# EAGLE schematic TEPIAmainboard (EAGLE 8.0.1)
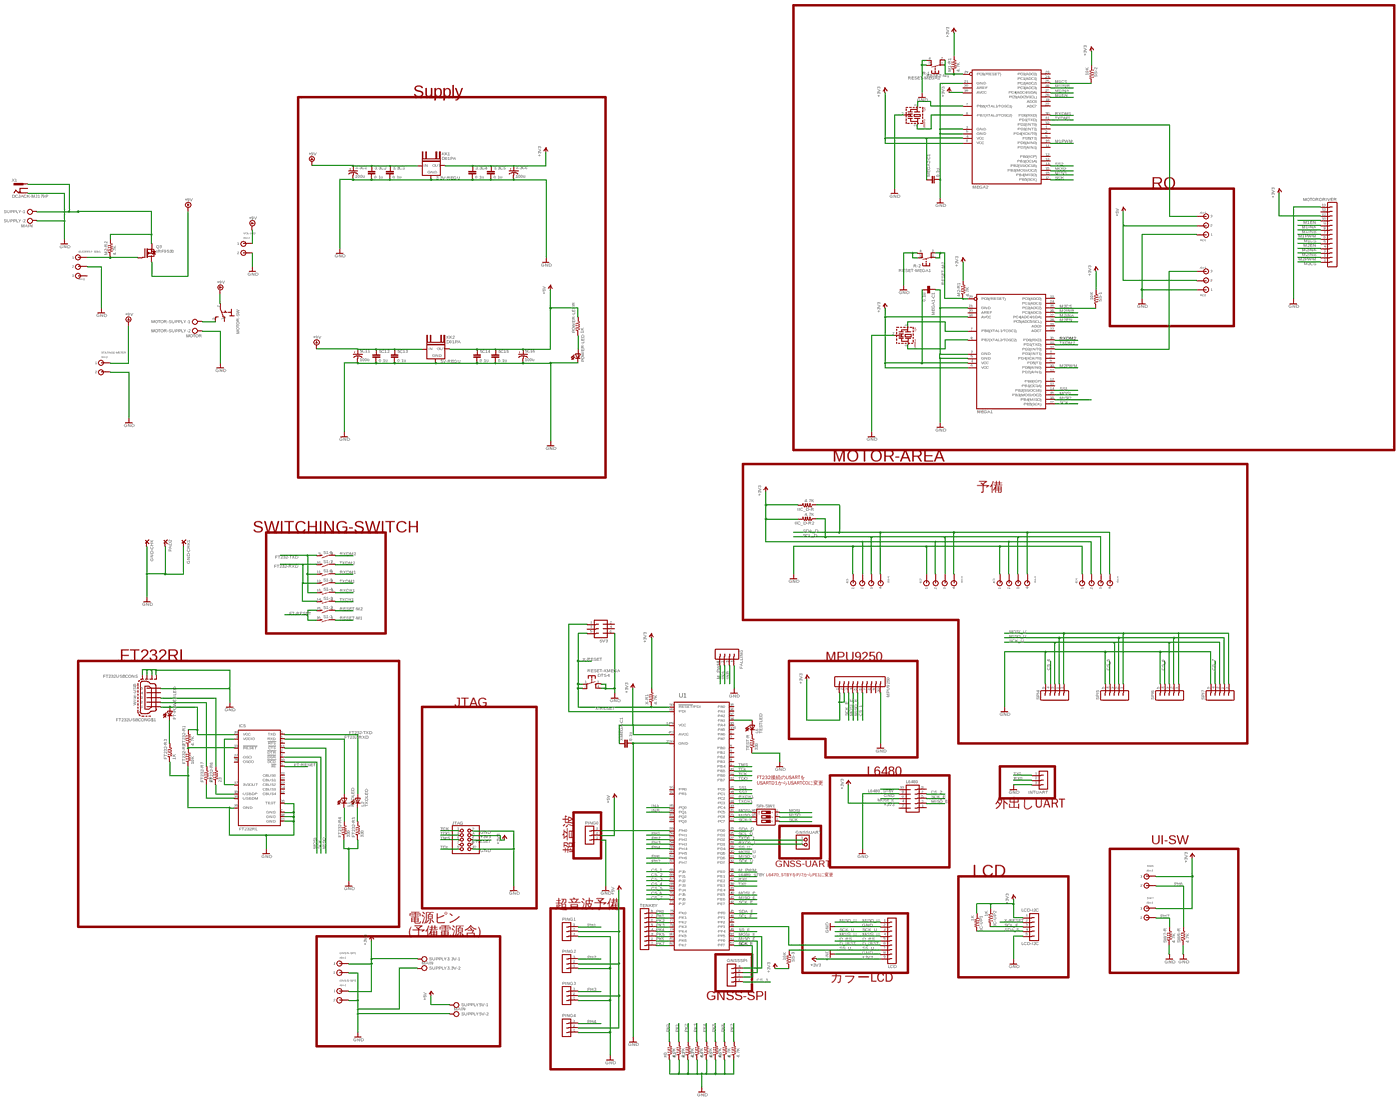
[diagram p0: schematic, sheet 1, overview]
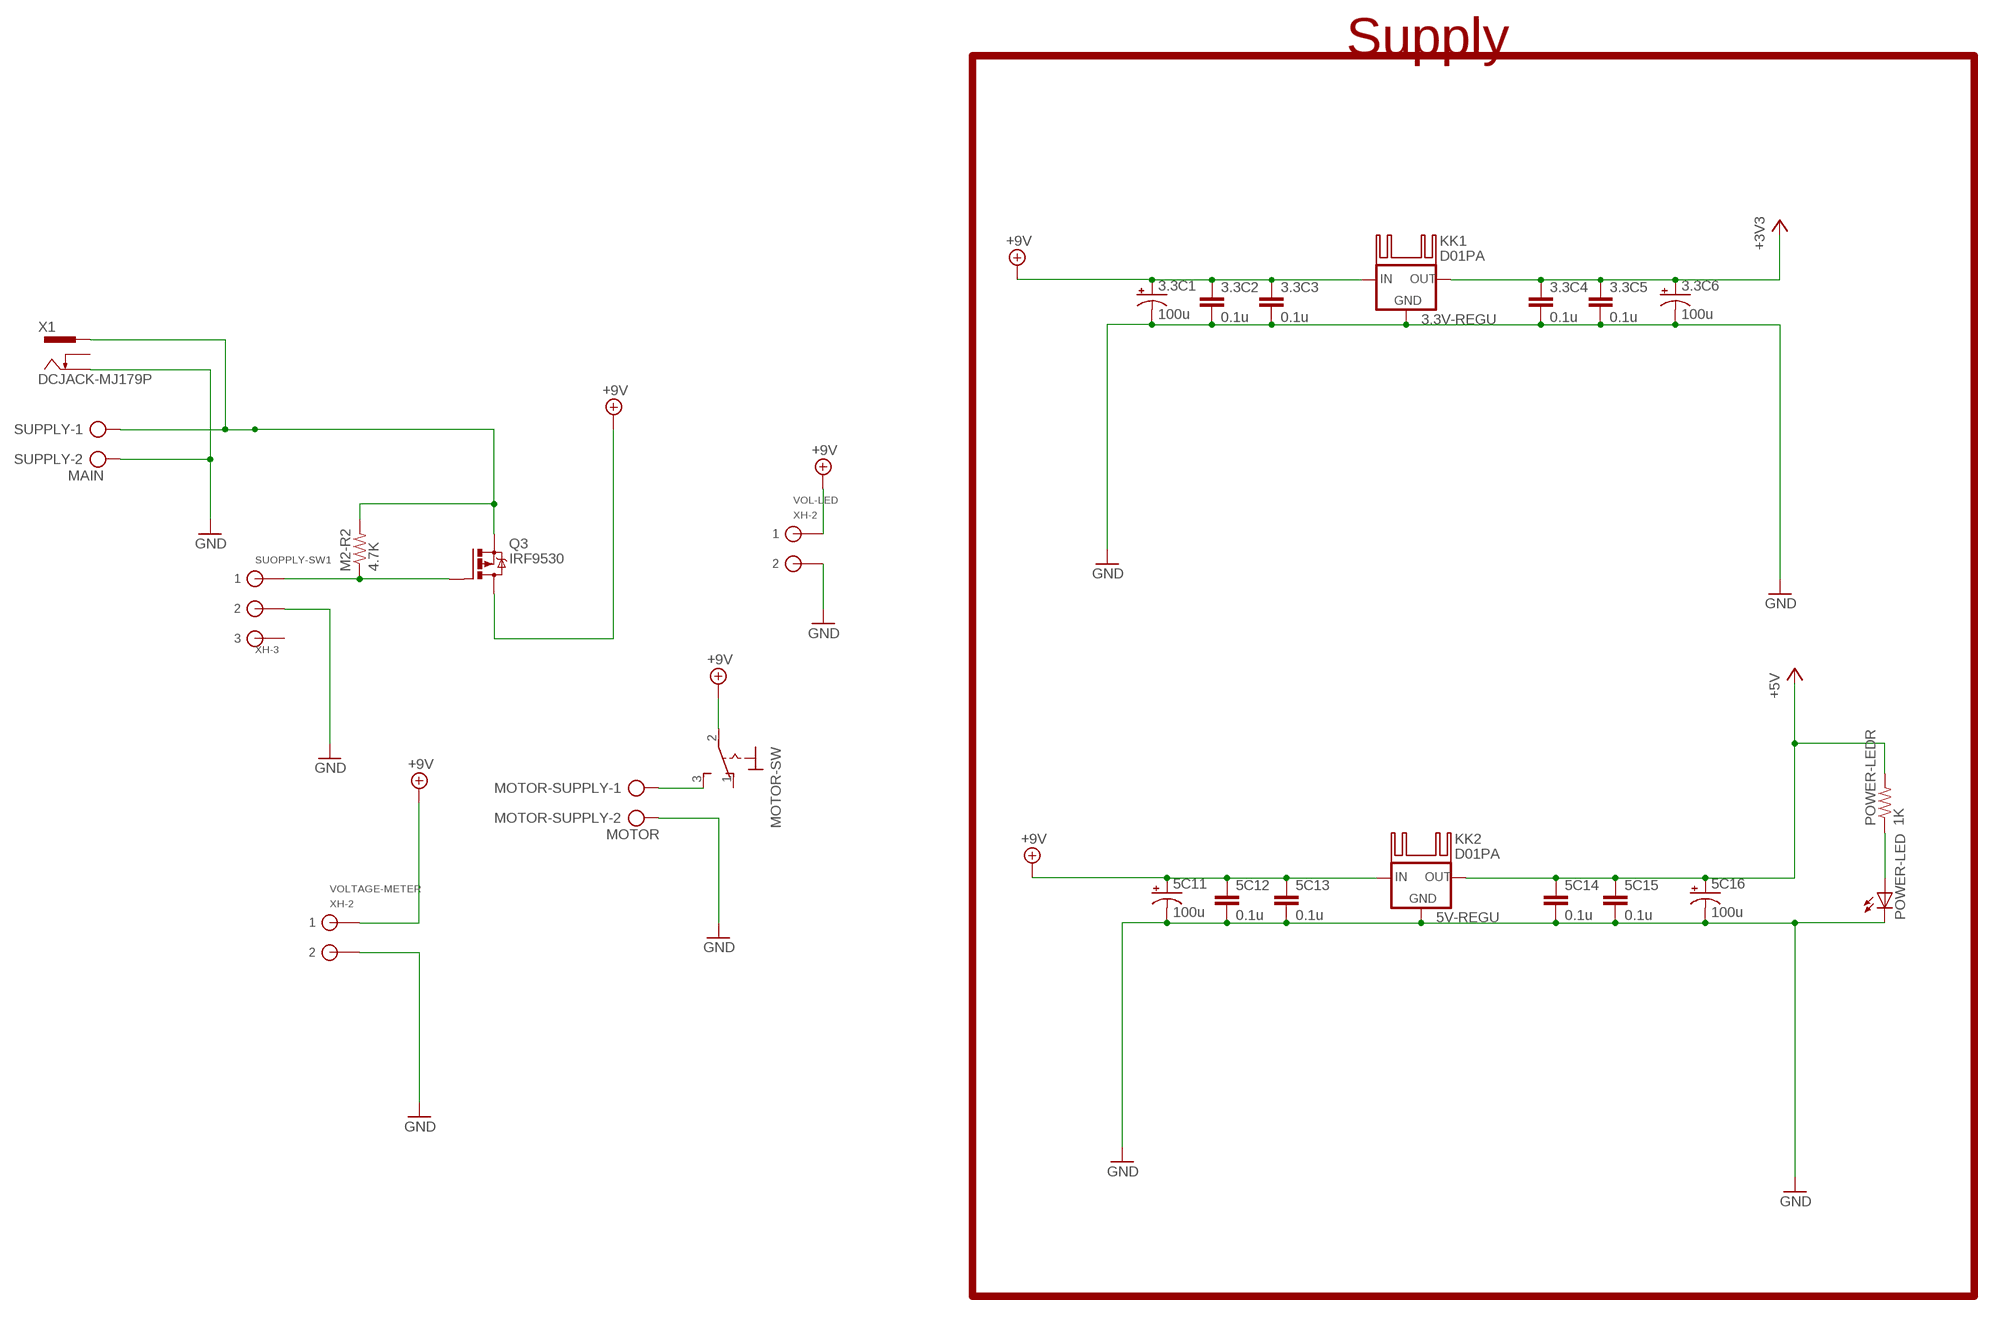
[diagram p1: schematic, sheet 1, part 1 of 4]
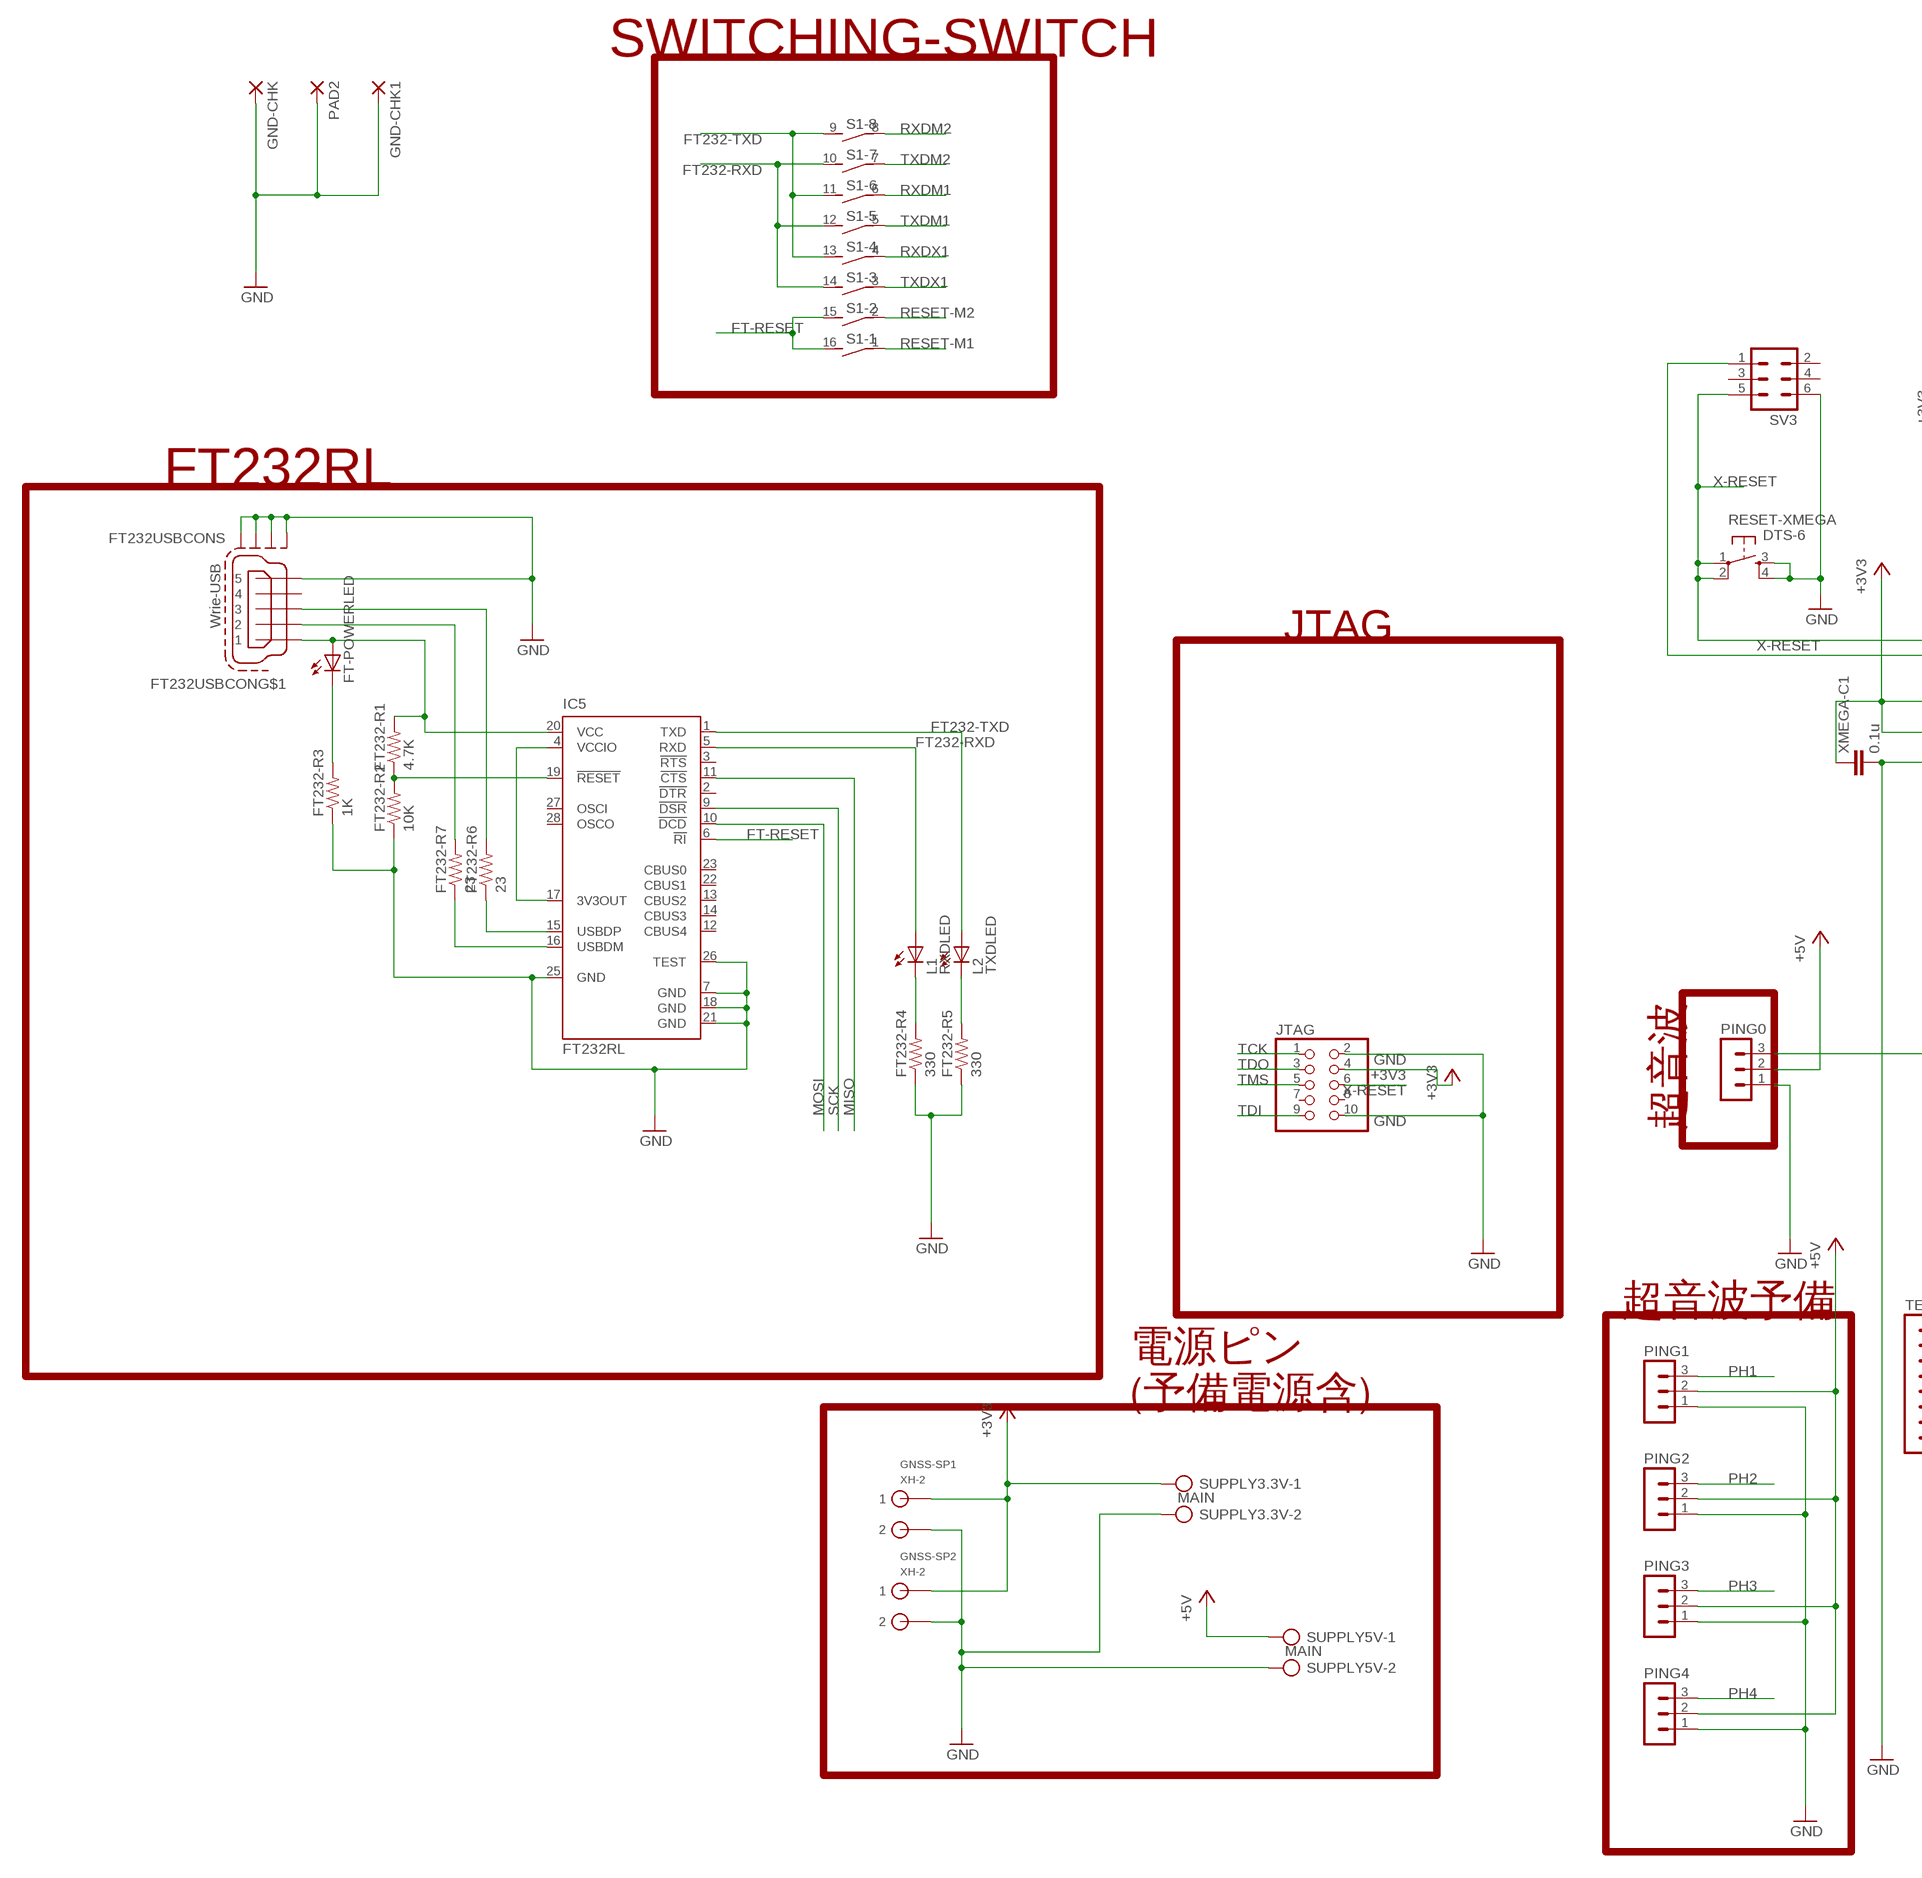
[diagram p2: schematic, sheet 1, part 2 of 4]
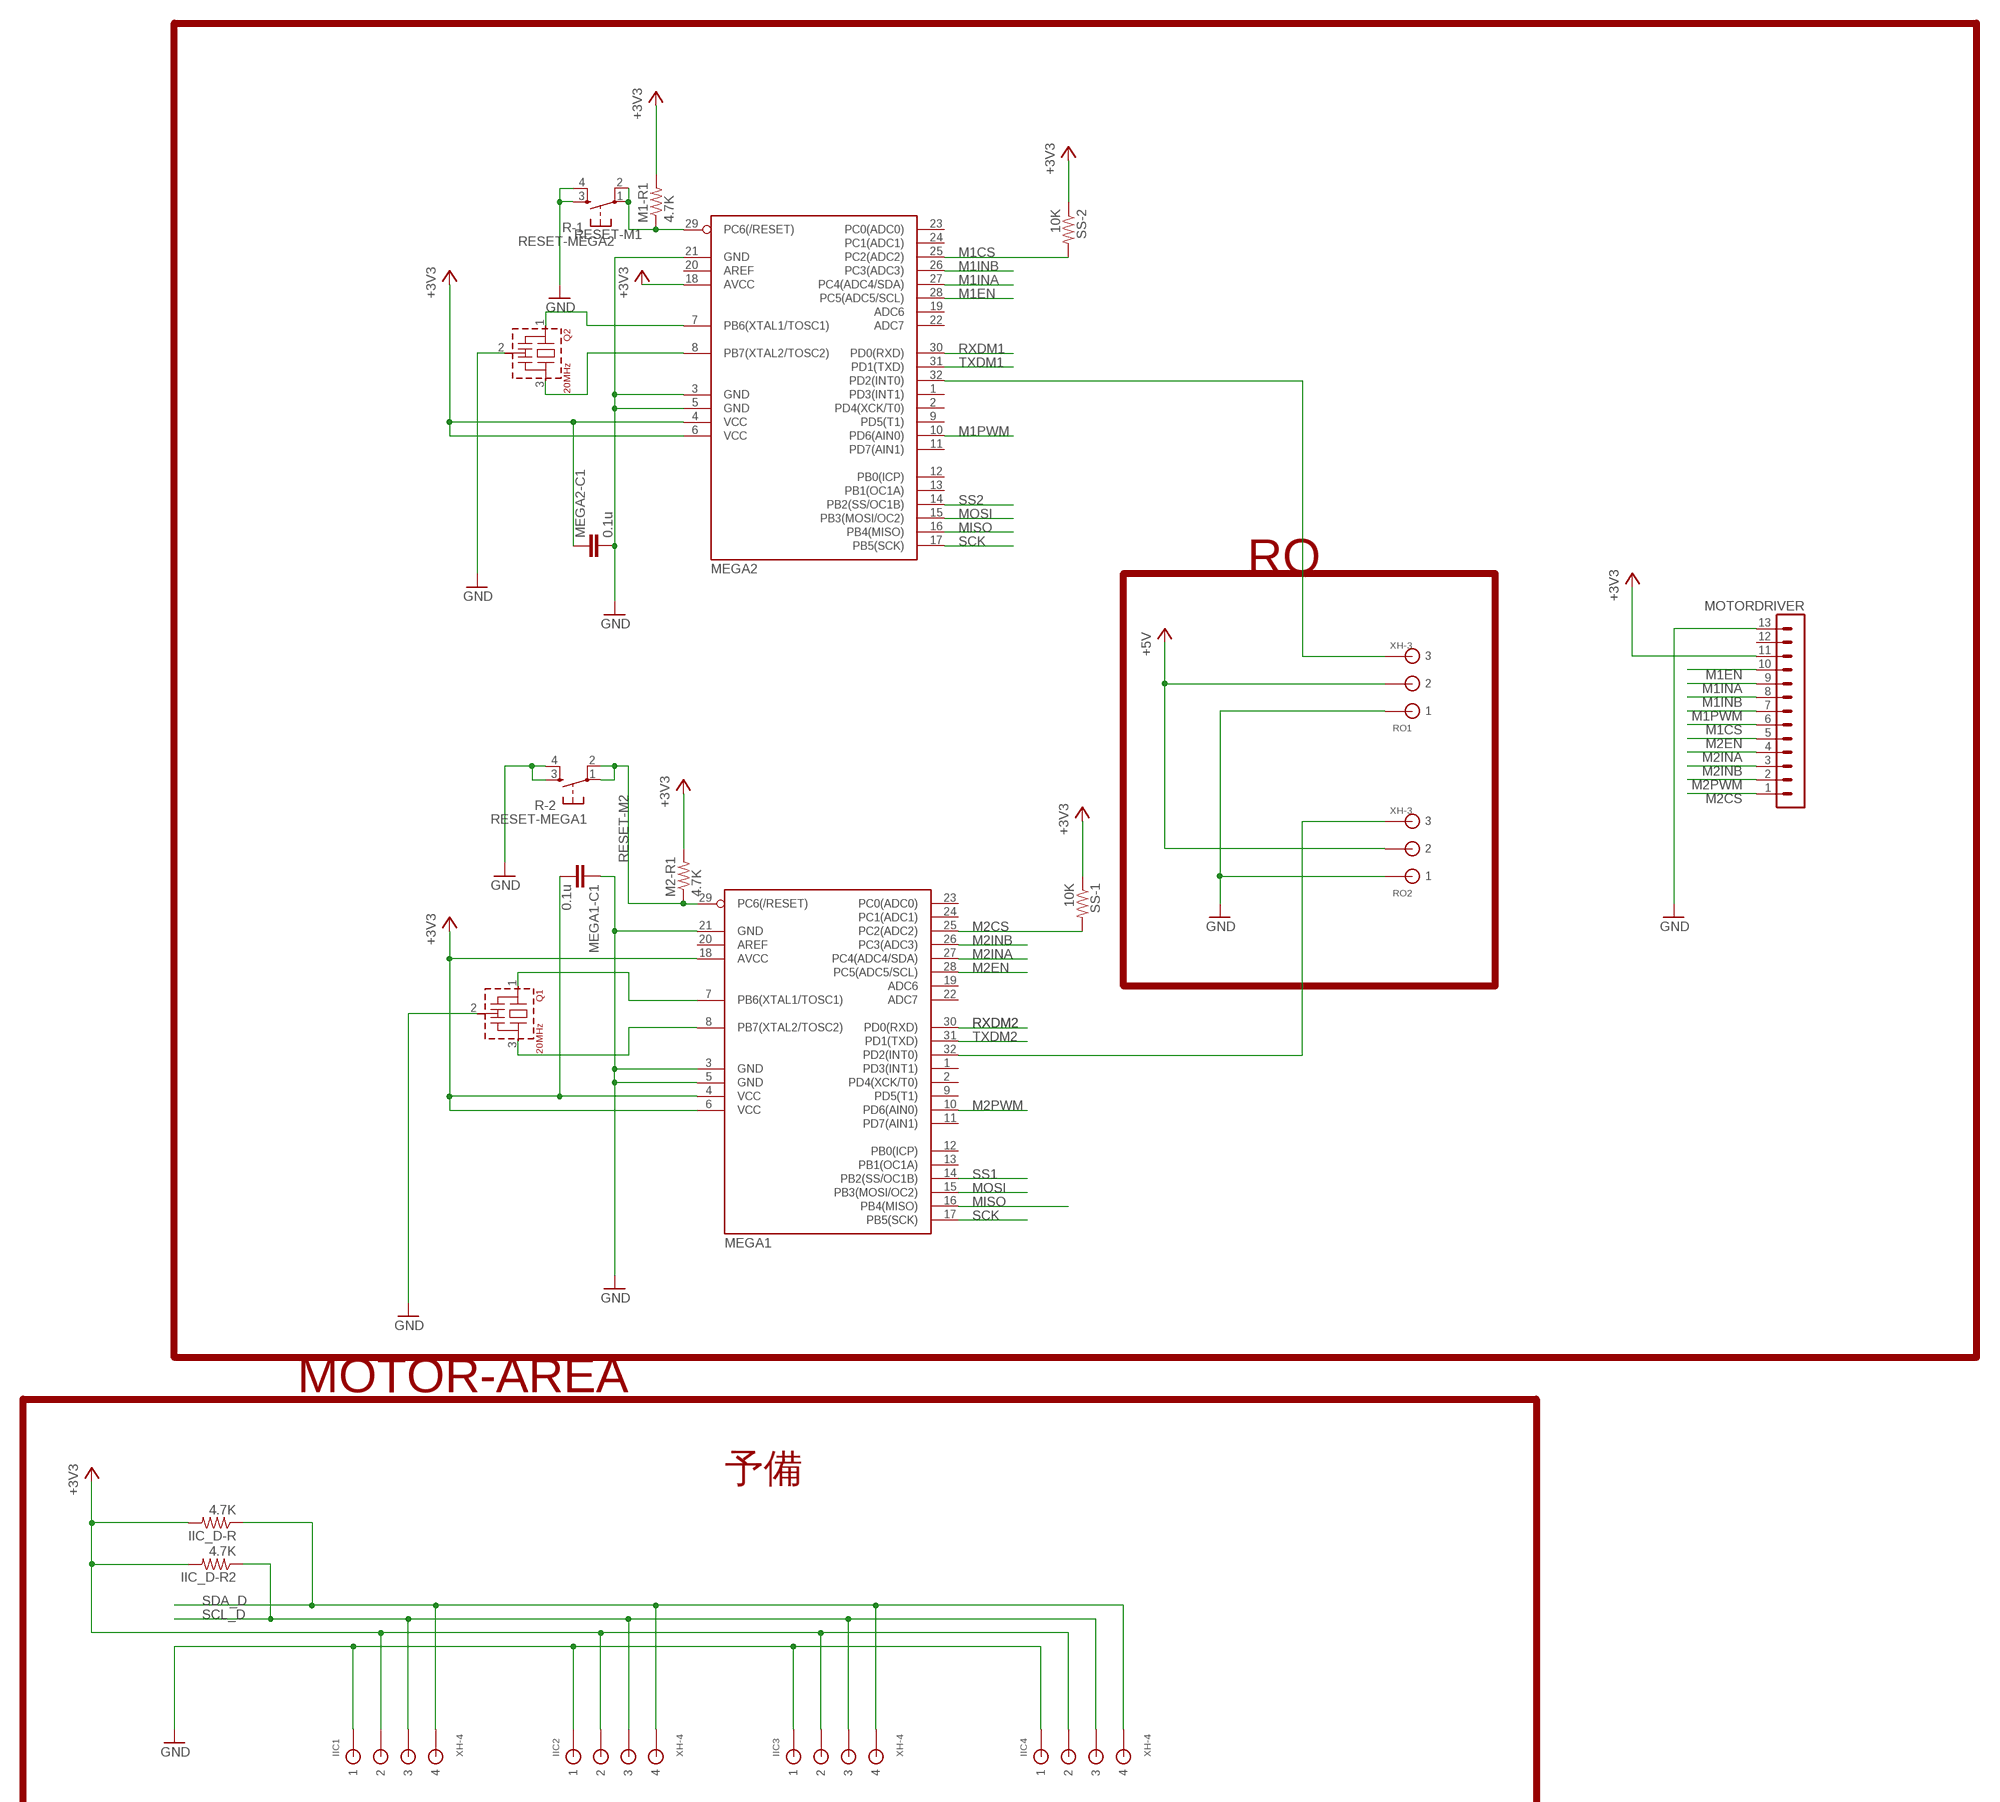
[diagram p3: schematic, sheet 1, part 3 of 4]
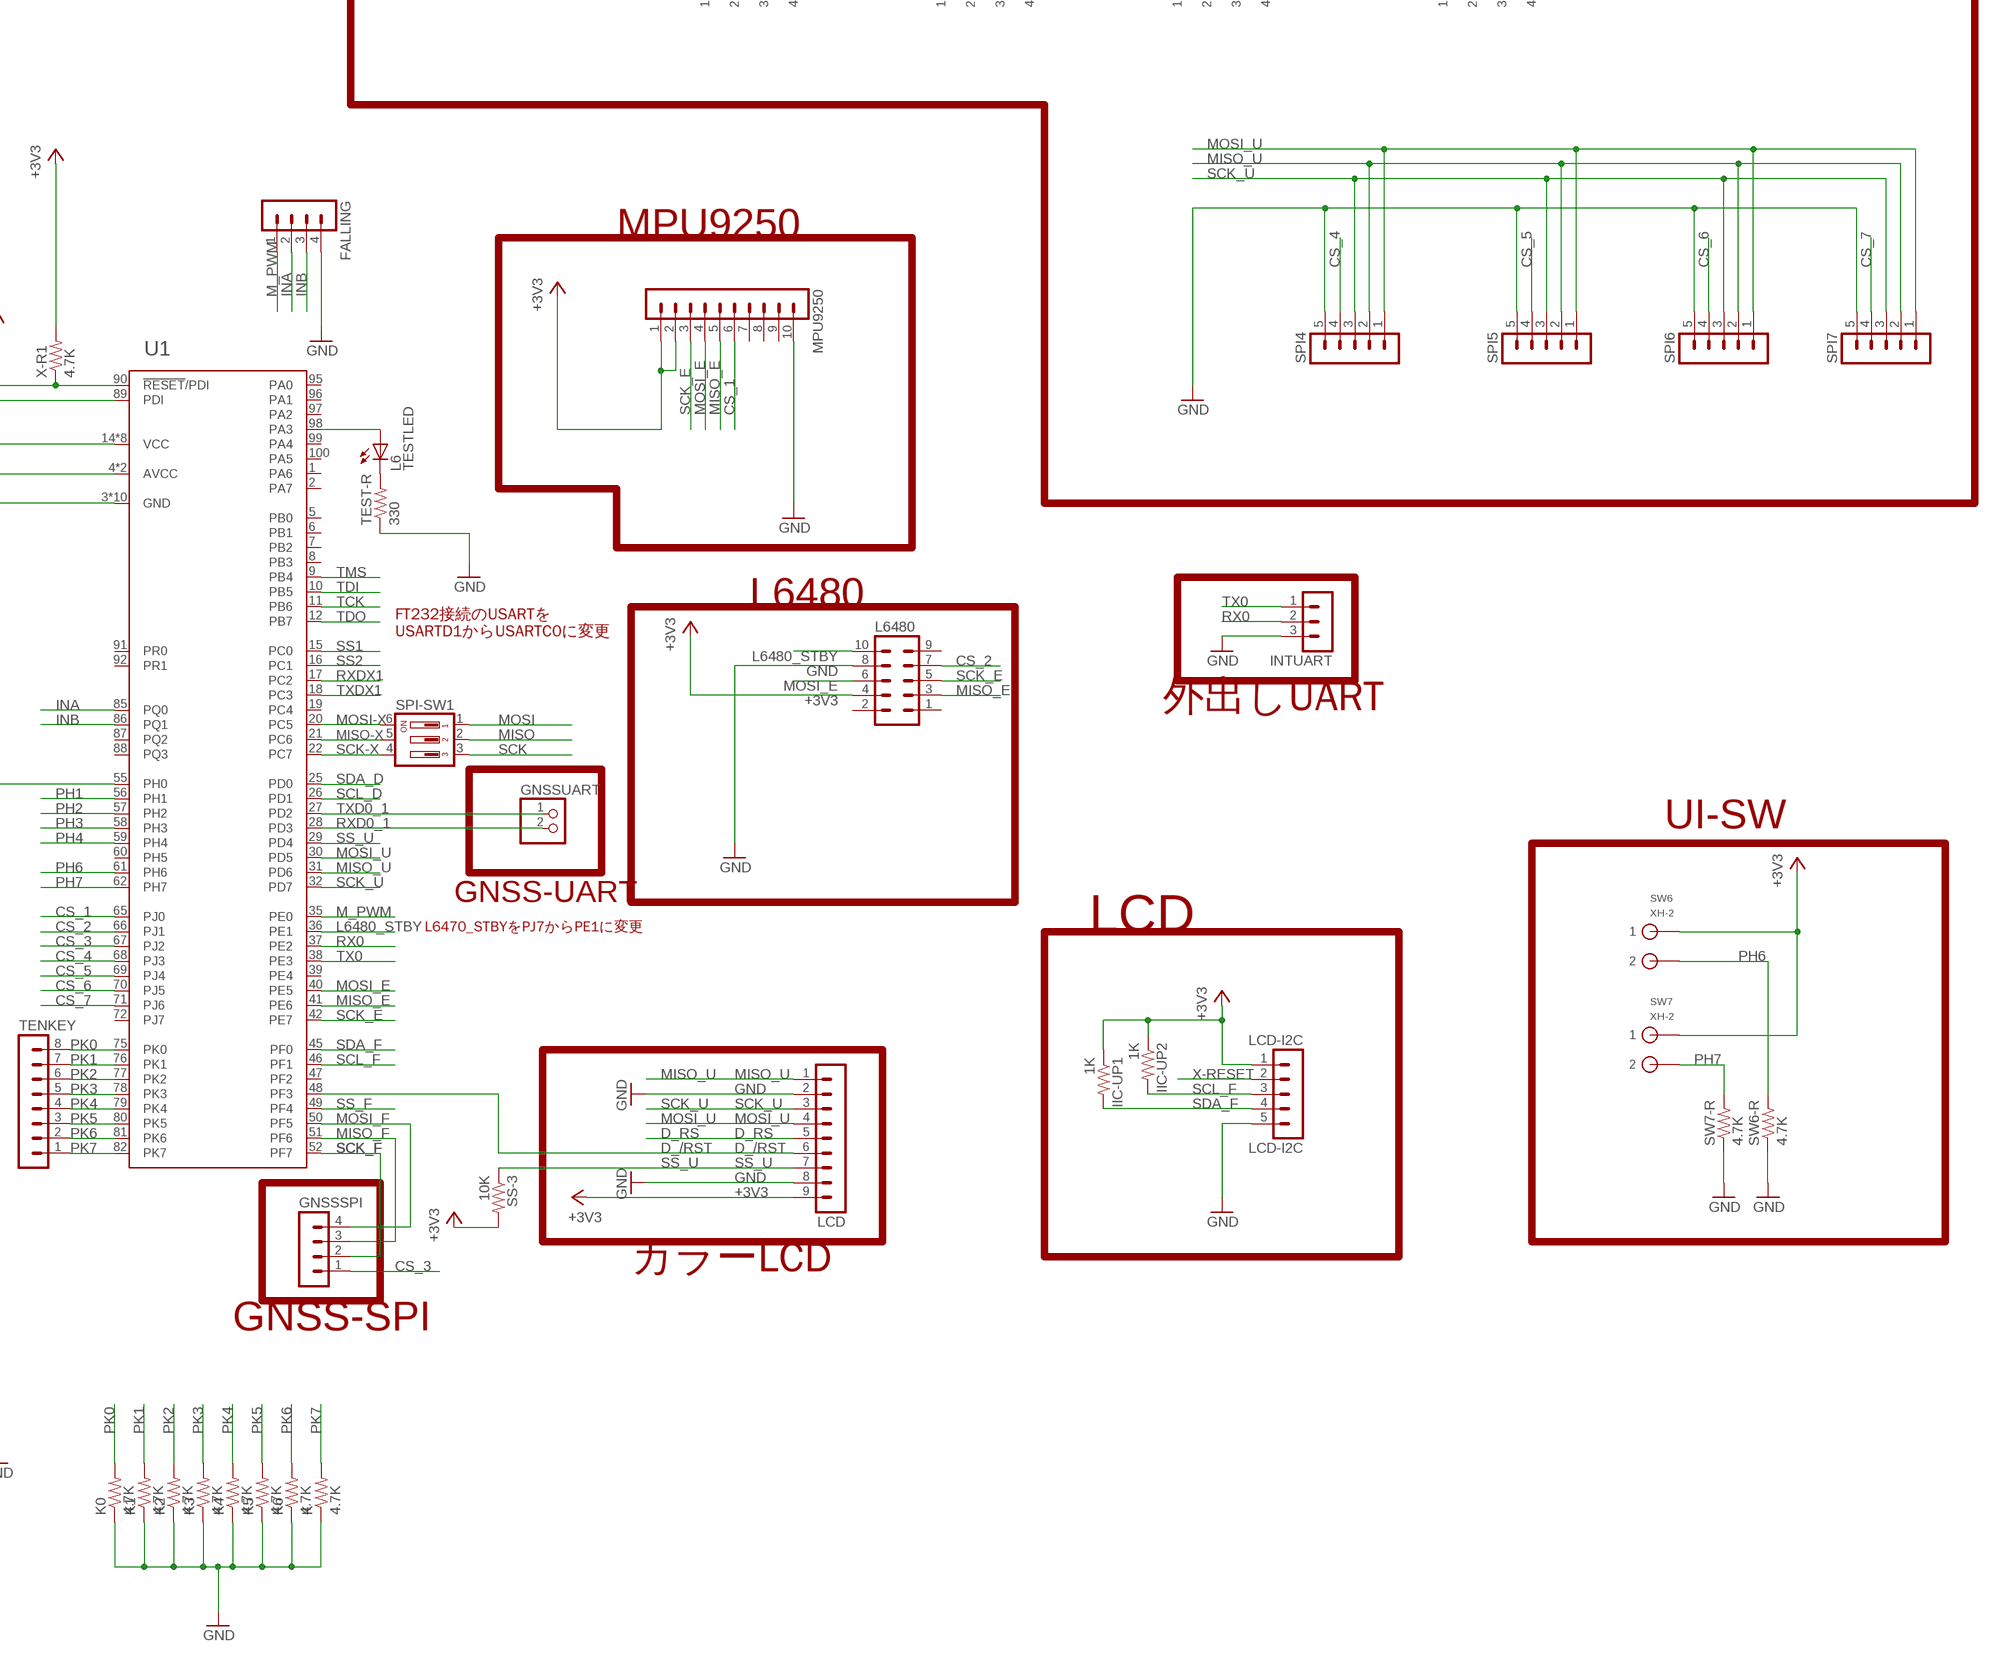
[diagram p4: schematic, sheet 1, part 4 of 4]

## Parts
3.3C1  100u  CPOL-USE2.5-6  [E2,5-6]
3.3C2  0.1u  C-EUC0805  [C0805]
3.3C3  0.1u  C-EUC0805  [C0805]
3.3C4  0.1u  C-EUC0805  [C0805]
3.3C5  0.1u  C-EUC0805  [C0805]
3.3C6  100u  CPOL-USE2.5-6  [E2,5-6]
3.3V-REGU  78XXS  [78XXS]
5C11  100u  CPOL-USE2.5-6  [E2,5-6]
5C12  0.1u  C-EUC0805  [C0805]
5C13  0.1u  C-EUC0805  [C0805]
5C14  0.1u  C-EUC0805  [C0805]
5C15  0.1u  C-EUC0805  [C0805]
5C16  100u  CPOL-USE2.5-6  [E2,5-6]
5V-REGU  78XXS  [78XXS]
FALLING  MA04-1  [MA04-1]
FT232-R1  4.7K  R-US_R0805  [R0805]
FT232-R2  10K  R-US_R0805  [R0805]
FT232-R3  1K  R-US_R0805  [R0805]
FT232-R4  330  R-US_R0805  [R0805]
FT232-R5  330  R-US_R0805  [R0805]
FT232-R6  23  R-US_R0805  [R0805]
FT232-R7  23  R-US_R0805  [R0805]
FT232USBCON  Wrie-USB  MINI-USB-SCHIELD-32005-201  [32005-201]
FT-POWERLED  LEDCHIPLED_0805  [CHIPLED_0805]
GND-CHK  2,15/1,0  [2,15/1,0]
GND-CHK1  2,15/1,0  [2,15/1,0]
GNSS-SP1  XH-2  [CON2]
GNSS-SP2  XH-2  [CON2]
GNSSSPI  MA04-1  [MA04-1]
GNSSUART  PINHD-1X2  [1X02]
IC5  FT232RL  [SSOP28]
IIC1  XH-4  [CON4]
IIC2  XH-4  [CON4]
IIC3  XH-4  [CON4]
IIC4  XH-4  [CON4]
IIC-UP1  1K  R-US_R0805  [R0805]
IIC-UP2  1K  R-US_R0805  [R0805]
IIC_D-R  4.7K  R-US_R0805  [R0805]
IIC_D-R2  4.7K  R-US_R0805  [R0805]
INTUART  MA03-1  [MA03-1]
JTAG  20021221-00010C4LF  [20021221-00010C4LF]
K  4.7K  R-US_R0805  [R0805]
K0  4.7K  R-US_R0805  [R0805]
K1  4.7K  R-US_R0805  [R0805]
K2  4.7K  R-US_R0805  [R0805]
K3  4.7K  R-US_R0805  [R0805]
K4  4.7K  R-US_R0805  [R0805]
K5  4.7K  R-US_R0805  [R0805]
K6  4.7K  R-US_R0805  [R0805]
KK1  D01PA  [D01PA]
KK2  D01PA  [D01PA]
L1  RXDLED  LEDCHIPLED_0805  [CHIPLED_0805]
L2  TXDLED  LEDCHIPLED_0805  [CHIPLED_0805]
L6  TESTLED  LEDCHIPLED_0805  [CHIPLED_0805]
L6480  MA05-2  [MA05-2]
LCD  MA09-1  [MA09-1]
LCD-I2C  LCD-I2C  MA05-1  [MA05-1]
M1-R1  4.7K  R-US_R0805  [R0805]
M2-R1  4.7K  R-US_R0805  [R0805]
M2-R2  4.7K  R-US_R0805  [R0805]
MEGA1  MEGA8-AI  [TQFP32-08]
MEGA1-C1  0.1u  C-EUC0805  [C0805]
MEGA2  MEGA8-AI  [TQFP32-08]
MEGA2-C1  0.1u  C-EUC0805  [C0805]
MOTOR-SUPPLY  MOTOR  AK500/2  [AK500/2]
MOTOR-SW  320-916  [320-916]
MOTORDRIVER  MA13-1  [MA13-1]
MPU9250  MA10-1  [MA10-1]
PAD2  SMD5  [SMD2,54-5,08]
PING0  MA03-1  [MA03-1]
PING1  MA03-1  [MA03-1]
PING2  MA03-1  [MA03-1]
PING3  MA03-1  [MA03-1]
PING4  MA03-1  [MA03-1]
POWER-LED  LEDCHIPLED_0805  [CHIPLED_0805]
POWER-LEDR  1K  R-US_R0805  [R0805]
Q1  20MHz  CSTLS_X  [CSTLS_X]
Q2  20MHz  CSTLS_X  [CSTLS_X]
Q3  IRF9530  [TO220BV]
RESET-MEGA1  R-2  DTS-6  [DTS-6]
RESET-MEGA2  R-1  DTS-6  [DTS-6]
RESET-XMEGA  DTS-6  [DTS-6]
RO1  XH-3  [CON3]
RO2  XH-3  [CON3]
S1  DIP08S  [DIP08S]
SPI4  MA05-1  [MA05-1]
SPI5  MA05-1  [MA05-1]
SPI6  MA05-1  [MA05-1]
SPI7  MA05-1  [MA05-1]
SPI-SW1  DIP03YL  [DIP03YL]
SS-1  10K  R-US_R0805  [R0805]
SS-2  10K  R-US_R0805  [R0805]
SS-3  10K  R-US_R0805  [R0805]
SUOPPLY-SW1  XH-3  [CON3]
SUPPLY  MAIN  AK500/2  [AK500/2]
SUPPLY3.3V  MAIN  AK500/2  [AK500/2]
SUPPLY5V  MAIN  AK500/2  [AK500/2]
SV3  ML6  [ML6]
SW6  XH-2  [CON2]
SW6-R  4.7K  R-US_R0805  [R0805]
SW7  XH-2  [CON2]
SW7-R  4.7K  R-US_R0805  [R0805]
TENKEY  MA08-1  [MA08-1]
TEST-R  330  R-US_R0805  [R0805]
U1  ATXMEGA128A1U-AU  [TQFP-100A-100]
VOL-LED  XH-2  [CON2]
VOLTAGE-METER  XH-2  [CON2]
X1  DCJACK-MJ179P  [MJ-179P]
X-R1  4.7K  R-US_R0805  [R0805]
XMEGA-C1  0.1u  C-EUC0805  [C0805]

## Nets
+3V3: 3.3C4.1 3.3C5.1 3.3C6.+ 3.3V-REGU.OUT GNSS-SP1.P$1 GNSS-SP2.P$1 IIC1.P$2 IIC2.P$2 IIC3.P$2 IIC4.P$2 IIC-UP1.1 IIC-UP2.1 IIC_D-R2.2 IIC_D-R.2 JTAG.4 L6480.4 LCD-I2C.1 LCD.9 M1-R1.2 M2-R1.2 MEGA1-C1.2 MEGA1.4(VCC) MEGA1.6(VCC) MEGA1.18(AVCC) MEGA2-C1.1 MEGA2.4(VCC) MEGA2.6(VCC) MEGA2.18(AVCC) MOTORDRIVER.11 MPU9250.1 MPU9250.2 SS-1.1 SS-2.1 SS-3.2 SUPPLY3.3V.1 SW6.P$1 SW7.P$1 U1.4(AVCC) U1.14(VCC) U1.24(VCC) U1.34(VCC) U1.44(VCC) U1.54(VCC) U1.64(VCC) U1.74(VCC) U1.83(VCC) U1.94(AVCC) X-R1.2 XMEGA-C1.1
+5V: 5C14.1 5C15.1 5C16.+ 5V-REGU.OUT PING0.2 PING1.2 PING2.2 PING3.2 PING4.2 POWER-LEDR.2 RO1.P$2 RO2.P$2 SUPPLY5V.1
+9V: 3.3C1.+ 3.3C2.1 3.3C3.1 3.3V-REGU.IN 5C11.+ 5C12.1 5C13.1 5V-REGU.IN MOTOR-SW.2(P) Q3.D VOL-LED.P$1 VOLTAGE-METER.P$1
CS_1: MPU9250.6 U1.65(PJ0)
CS_2: L6480.7 U1.66(PJ1)
CS_3: GNSSSPI.1 U1.67(PJ2)
CS_4: SPI4.4 U1.68(PJ3)
CS_5: SPI5.4 U1.69(PJ4)
CS_6: SPI6.4 U1.70(PJ5)
CS_7: SPI7.4 U1.71(PJ6)
D_/RST: LCD.6 U1.48(PF3)
D_RS: LCD.5
FT232-RXD: IC5.5(RXD) L1.A S1.10 S1.12 S1.14
FT232-TXD: IC5.1(TXD) L2.A S1.9 S1.11 S1.13
FT-POWERLED: FT232-R3.2 FT-POWERLED.C
FT-RESET: IC5.6(!RI) S1.15 S1.16
GND: 3.3C1.- 3.3C2.2 3.3C3.2 3.3C4.2 3.3C5.2 3.3C6.- 3.3V-REGU.GND 5C11.- 5C12.2 5C13.2 5C14.2 5C15.2 5C16.- 5V-REGU.GND FALLING.4 FT232-R2.1 FT232-R3.1 FT232-R4.1 FT232-R5.1 FT232USBCON.5 FT232USBCON.M1(S:S1) FT232USBCON.M2(S:S2) FT232USBCON.M3(S:S3) FT232USBCON.M4(S:S4) GND-CHK1.1(P) GND-CHK.1(P) GNSS-SP1.P$2 GNSS-SP2.P$2 IC5.7(GND) IC5.18(GND) IC5.21(GND) IC5.25(GND) IC5.26(TEST) IIC1.P$1 IIC2.P$1 IIC3.P$1 IIC4.P$1 INTUART.3 JTAG.2 JTAG.10 K0.1 K1.1 K2.1 K3.1 K4.1 K5.1 K6.1 K.1 L6480.8 LCD-I2C.5 LCD.2 LCD.8 MEGA1-C1.1 MEGA1.3(GND) MEGA1.5(GND) MEGA1.21(GND) MEGA2-C1.2 MEGA2.3(GND) MEGA2.5(GND) MEGA2.21(GND) MOTOR-SUPPLY.2 MOTORDRIVER.13 MPU9250.10 PAD2.1(P) PING0.1 PING1.1 PING2.1 PING3.1 PING4.1 POWER-LED.C Q1.2(VSS) Q2.2(VSS) RESET-MEGA1.3 RESET-MEGA1.4 RESET-MEGA2.3 RESET-MEGA2.4 RESET-XMEGA.3 RESET-XMEGA.4 RO1.P$1 RO2.P$1 SPI4.5 SPI5.5 SPI6.5 SPI7.5 SUOPPLY-SW1.P$2 SUPPLY3.3V.2 SUPPLY5V.2 SUPPLY.2 SV3.6 SW6-R.1 SW7-R.1 TEST-R.1 U1.3(GND) U1.13(GND) U1.23(GND) U1.33(GND) U1.43(GND) U1.53(GND) U1.63(GND) U1.73(GND) U1.84(GND) U1.93(GND) VOL-LED.P$2 VOLTAGE-METER.P$2 X1.2 XMEGA-C1.2
INA: FALLING.2 U1.85(PQ0)
INB: FALLING.3 U1.86(PQ1)
L6480_STBY: L6480.10 U1.36(PE1)
M1CS: MEGA2.25(PC2(ADC2)) MOTORDRIVER.6 SS-2.2
M1EN: MEGA2.28(PC5(ADC5/SCL)) MOTORDRIVER.10
M1INA: MEGA2.27(PC4(ADC4/SDA)) MOTORDRIVER.9
M1INB: MEGA2.26(PC3(ADC3)) MOTORDRIVER.8
M1PWM: MEGA2.10(PD6(AIN0)) MOTORDRIVER.7
M2CS: MEGA1.25(PC2(ADC2)) MOTORDRIVER.1 SS-1.2
M2EN: MEGA1.28(PC5(ADC5/SCL)) MOTORDRIVER.5
M2INA: MEGA1.27(PC4(ADC4/SDA)) MOTORDRIVER.4
M2INB: MEGA1.26(PC3(ADC3)) MOTORDRIVER.3
M2PWM: MEGA1.10(PD6(AIN0)) MOTORDRIVER.2
M_PWM: FALLING.1 U1.35(PE0)
MISO: IC5.11(!CTS) MEGA1.16(PB4(MISO)) MEGA2.16(PB4(MISO)) SPI-SW1.2
MISO-X: SPI-SW1.5 U1.21(PC6)
MISO_E: L6480.3 MPU9250.5 U1.41(PE6)
MISO_F: GNSSSPI.3 U1.51(PF6)
MISO_U: LCD.1 SPI4.2 SPI5.2 SPI6.2 SPI7.2 U1.31(PD6)
MOSI: IC5.10(!DCD) MEGA1.15(PB3(MOSI/OC2)) MEGA2.15(PB3(MOSI/OC2)) SPI-SW1.1
MOSI-X: SPI-SW1.6 U1.20(PC5)
MOSI_E: L6480.6 MPU9250.4 U1.40(PE5)
MOSI_F: GNSSSPI.4 U1.50(PF5)
MOSI_U: LCD.4 SPI4.1 SPI5.1 SPI6.1 SPI7.1 U1.30(PD5)
N$2: MEGA2.32(PD2(INT0)) RO1.P$3
N$5: POWER-LED.A POWER-LEDR.1
N$6: MEGA1.32(PD2(INT0)) RO2.P$3
N$7: M2-R2.2 Q3.S SUPPLY.1 X1.1
N$8: SV3.1 U1.89(PDI)
N$9: FT232-R6.1 IC5.15(USBDP)
N$10: MEGA1.7(PB6(XTAL1/TOSC1)) Q1.1
N$11: MEGA1.8(PB7(XTAL2/TOSC2)) Q1.3
N$12: FT232-R6.2 FT232USBCON.3
N$14: FT232-R7.1 IC5.16(USBDM)
N$15: L6.A U1.98(PA3)
N$18: L6.C TEST-R.2
N$20: MEGA2.7(PB6(XTAL1/TOSC1)) Q2.1
N$23: FT232-R7.2 FT232USBCON.2
N$24: MEGA2.8(PB7(XTAL2/TOSC2)) Q2.3
N$25: FT232-R1.2 FT232USBCON.1 FT-POWERLED.A IC5.20(VCC)
N$26: FT232-R1.1 FT232-R2.2 IC5.19(!RESET)
N$27: FT232-R4.2 L1.C
N$28: FT232-R5.2 L2.C
N$29: M2-R2.1 Q3.G SUOPPLY-SW1.P$1
N$35: IC5.4(VCCIO) IC5.17(3V3OUT)
N$38: PING0.3 U1.55(PH0)
N$41: MOTOR-SUPPLY.1 MOTOR-SW.3(S)
PH1: PING1.3 U1.56(PH1)
PH2: PING2.3 U1.57(PH2)
PH3: PING3.3 U1.58(PH3)
PH4: PING4.3 U1.59(PH4)
PH6: SW6-R.2 SW6.P$2 U1.61(PH6)
PH7: SW7-R.2 SW7.P$2 U1.62(PH7)
PK0: K0.2 TENKEY.8 U1.75(PK0)
PK1: K1.2 TENKEY.7 U1.76(PK1)
PK2: K2.2 TENKEY.6 U1.77(PK2)
PK3: K3.2 TENKEY.5 U1.78(PK3)
PK4: K4.2 TENKEY.4 U1.79(PK4)
PK5: K5.2 TENKEY.3 U1.80(PK5)
PK6: K6.2 TENKEY.2 U1.81(PK6)
PK7: K.2 TENKEY.1 U1.82(PK7)
RESET-M1: M1-R1.1 MEGA2.29(PC6(/RESET)) RESET-MEGA2.1 RESET-MEGA2.2 S1.1
RESET-M2: M2-R1.1 MEGA1.29(PC6(/RESET)) RESET-MEGA1.1 RESET-MEGA1.2 S1.2
RX0: INTUART.2 U1.37(PE2)
RXD0_1: GNSSUART.2 U1.28(PD3)
RXDM1: MEGA2.30(PD0(RXD)) S1.6
RXDM2: MEGA1.30(PD0(RXD)) S1.8
RXDX1: S1.4 U1.17(PC2)
SCK: IC5.9(!DSR) MEGA1.17(PB5(SCK)) MEGA2.17(PB5(SCK)) SPI-SW1.3
SCK-X: SPI-SW1.4 U1.22(PC7)
SCK_E: L6480.5 MPU9250.3 U1.42(PE7)
SCK_F: GNSSSPI.2 U1.52(PF7)
SCK_U: LCD.3 SPI4.3 SPI5.3 SPI6.3 SPI7.3 U1.32(PD7)
SCL_D: IIC1.P$3 IIC2.P$3 IIC3.P$3 IIC4.P$3 IIC_D-R2.1 U1.26(PD1)
SCL_F: IIC-UP2.2 LCD-I2C.3 U1.46(PF1)
SDA_D: IIC1.P$4 IIC2.P$4 IIC3.P$4 IIC4.P$4 IIC_D-R.1 U1.25(PD0)
SDA_F: IIC-UP1.2 LCD-I2C.4 U1.45(PF0)
SS1: MEGA1.14(PB2(SS/OC1B)) U1.15(PC0)
SS2: MEGA2.14(PB2(SS/OC1B)) U1.16(PC1)
SS_F: U1.49(PF4)
SS_U: LCD.7 SS-3.1 U1.29(PD4)
TCK: JTAG.1 U1.11(PB6)
TDI: JTAG.9 U1.10(PB5)
TDO: JTAG.3 U1.12(PB7)
TMS: JTAG.5 U1.9(PB4)
TX0: INTUART.1 U1.38(PE3)
TXD0_1: GNSSUART.1 U1.27(PD2)
TXDM1: MEGA2.31(PD1(TXD)) S1.5
TXDM2: MEGA1.31(PD1(TXD)) S1.7
TXDX1: S1.3 U1.18(PC3)
X-RESET: JTAG.6 LCD-I2C.2 RESET-XMEGA.1 RESET-XMEGA.2 SV3.5 U1.90(!RESET!/PDI) X-R1.1
Unconnected: FT232USBCON.4 IC5.2(!DTR) IC5.3(!RTS) IC5.12(CBUS4) IC5.13(CBUS2) IC5.14(CBUS3) IC5.22(CBUS1) IC5.23(CBUS0) IC5.27(OSCI) IC5.28(OSCO) JTAG.7 JTAG.8 L6480.1 L6480.2 L6480.9 MEGA1.1(PD3(INT1)) MEGA1.2(PD4(XCK/T0)) MEGA1.9(PD5(T1)) MEGA1.11(PD7(AIN1)) MEGA1.12(PB0(ICP)) MEGA1.13(PB1(OC1A)) MEGA1.19(ADC6) MEGA1.20(AREF) MEGA1.22(ADC7) MEGA1.23(PC0(ADC0)) MEGA1.24(PC1(ADC1)) MEGA2.1(PD3(INT1)) MEGA2.2(PD4(XCK/T0)) MEGA2.9(PD5(T1)) MEGA2.11(PD7(AIN1)) MEGA2.12(PB0(ICP)) MEGA2.13(PB1(OC1A)) MEGA2.19(ADC6) MEGA2.20(AREF) MEGA2.22(ADC7) MEGA2.23(PC0(ADC0)) MEGA2.24(PC1(ADC1)) MOTOR-SW.1(O) MOTORDRIVER.12 MPU9250.7 MPU9250.8 MPU9250.9 SUOPPLY-SW1.P$3 SV3.2 SV3.3 SV3.4 U1.1(PA6) U1.2(PA7) U1.5(PB0) U1.6(PB1) U1.7(PB2) U1.8(PB3) U1.19(PC4) U1.39(PE4) U1.47(PF2) U1.60(PH5) U1.72(PJ7) U1.87(PQ2) U1.88(PQ3) U1.91(PR0) U1.92(PR1) U1.95(PA0) U1.96(PA1) U1.97(PA2) U1.99(PA4) U1.100(PA5) X1.3

## Notes on the sheet
- Supply
- RO
- MOTOR-AREA
- 予備
- SWITCHING-SWITCH
- FT232RL | MPU9250
- JTAG
- L6480
- FT232接続のUSARTを
  USARTD1からUSARTC0に変更
- 外出しUART
- UI-SW
- 超音波
- GNSS-UART
- L6470_STBYをPJ7からPE1に変更 | LCD
- 超音波予備
- 電源ピン
  (予備電源含)
- カラーLCD
- GNSS-SPI

## Library data of the parts
3.3C1 3.3C6 5C11 5C16 = rcl:CPOL-US: POLARIZED CAPACITOR, American symbol
3.3C2-3.3C5 5C12-5C15 MEGA1-C1 MEGA2-C1 XMEGA-C1 = rcl:C-EU: CAPACITOR, European symbol
3.3V-REGU 5V-REGU = v-reg:78XXS: VOLTAGE REGULATOR
FALLING GNSSSPI = 0con-lstb:MA04-1: PIN HEADER; OC_FARNELL: unknown; OC_NEWARK: unknown
FT232-R1-FT232-R7 IIC-UP1 IIC-UP2 IIC_D-R IIC_D-R2 K K0 K1-K6 M1-R1 M2-R1 M2-R2 POWER-LEDR SS-1-SS-3 SW6-R SW7-R TEST-R X-R1 = 0@Mylibrary-main1:R-US_: RESISTOR, American symbol
FT232USBCON = con-cypressindustries:MINI-USB-SCHIELD-: MINI USB-B Conector Source: www.cypressindustries.com; OC_FARNELL: unknown; OC_NEWARK: unknown
FT-POWERLED L1 L2 L6 POWER-LED = led:LED: LED OSRAM: - CHIPLED LG R971, LG N971, LY N971, LG Q971, LY Q971, LO R971, LY R971 LH N974, LH R974 LS Q976, LO Q976, LY Q976 LO Q996 - Hyper CHIPLED LW Q18S LB Q993, LB Q99A, LB R99A - SideLED LS A670, LO A670, LY A670, LG A670, LP A670 LB A673, LV A673, LT A673, LW A673 LH A674 LY A675 LS A676, LA A676, LO A676, LY A676, LW A676 LS A679, LY A679, LG A679 - Hyper Micro SIDELED® LS Y876, LA Y876, LO Y876, LY Y876 LT Y87S - SmartLED LW L88C, LW L88S LB L89C, LB L89S, LG L890 LS L89K, LO L89K, LY L89K LS L896, LA L896, LO L896, LY L896 - TOPLED LS T670, LO T670, LY T670, LG T670, LP T670 LSG T670, LSP T670, LSY T670, LOP T670, LYG T670 LG T671, LOG T671, LSG T671 LB T673, LV T673, LT T673, LW T673 LH T674 LS T676, LA T676, LO T676, LY T676, LB T676, LH T676, LSB T676, LW T676 LB T67C, LV T67C, LT T67C, LS T67K, LO T67K, LY T67K, LW E67C LS E67B, LA E67B, LO E67B, LY E67B, LB E67C, LV E67C, LT E67C LW T67C LS T679, LY T679, LG T679 LS T770, LO T770, LY T770, LG T770, LP T770 LB T773, LV T773, LT T773, LW T773 LH T774 LS E675, LA E675, LY E675, LS T675 LS T776, LA T776, LO T776, LY T776, LB T776 LHGB T686 LT T68C, LB T68C - Hyper Mini TOPLED® LB M676 - Mini TOPLED Santana® LG M470 LS M47K, LO M47K, LY M47K Source: http://www.osram.convergy.de LUXEON: - LUMILED® LXK2-PW12-R00, LXK2-PW12-S00, LXK2-PW14-U00, LXK2-PW14-V00 LXK2-PM12-R00, LXK2-PM12-S00, LXK2-PM14-U00 LXK2-PE12-Q00, LXK2-PE12-R00, LXK2-PE12-S00, LXK2-PE14-T00, LXK2-PE14-U00 LXK2-PB12-K00, LXK2-PB12-L00, LXK2-PB12-M00, LXK2-PB14-N00, LXK2-PB14-P00, LXK2-PB14-Q00 LXK2-PR12-L00, LXK2-PR12-M00, LXK2-PR14-Q00, LXK2-PR14-R00 LXK2-PD12-Q00, LXK2-PD12-R00, LXK2-PD12-S00 LXK2-PH12-R00, LXK2-PH12-S00 LXK2-PL12-P00, LXK2-PL12-Q00, LXK2-PL12-R00 Source: www.luxeon.com KINGBRIGHT: KA-3528ASYC Source: www.kingbright.com
GND-CHK GND-CHK1 = wirepad:2,15/1,0: THROUGH-HOLE PAD
GNSS-SP1 GNSS-SP2 SW6 SW7 = 0@Mylibrary-main1:XH-2: low insertion CON
GNSSUART = 0pinhead:PINHD-1X2: PIN HEADER
IC5 = ftdichip:FT232R: Source: http://www.ftdichip.com/Documents/DataSheets/DS_FT232R_v104.pdf; MPN: FT232RL; OC_FARNELL: 1146032; OC_NEWARK: 91K9918
IIC1-IIC4 = 0@Mylibrary-main1:XH-4: Low insertion connector 4pin
INTUART PING0 PING1-PING4 = 0con-lstb:MA03-1: PIN HEADER; OC_FARNELL: unknown; OC_NEWARK: unknown
JTAG = fci:20021221-00010C4LF: MINITEK 127 SHROUDED HDR Source: http://portal.fciconnect.com/Comergent//fci/drawing/20021221.pdf
KK1 KK2 = heatsink:D01PA: HEATSINK distributor Schukat
L6480 = 0con-lstb:MA05-2: PIN HEADER; OC_FARNELL: unknown; OC_NEWARK: unknown
LCD = 0con-lstb:MA09-1: PIN HEADER; OC_FARNELL: unknown; OC_NEWARK: unknown
LCD-I2C = con-lstb-forprint:MA05-1: PIN HEADER; OC_FARNELL: unknown; OC_NEWARK: unknown
MEGA1 MEGA2 = atmel:MEGA8: MICROCONTROLLER 8 Kbytes FLASH, 1 kbytes SRAM, 512 bytes EEPROM, USART, 6-channel 10 bit ADC, 2-channel 8 bit ADC Pin compatible with Atmega48, ATMega88, ATMega168 Source: avr.lbr; MPN: ATMEGA8-16AU; OC_FARNELL: 9171371; OC_NEWARK: 73M8863
MOTOR-SUPPLY SUPPLY SUPPLY3.3V SUPPLY5V = con-ptr500:AK500/2: CONNECTOR; OC_FARNELL: unknown; OC_NEWARK: unknown
MOTOR-SW = 0switch:320-916: TOGGLE SWITCH distributor RS Components
MOTORDRIVER = con-lstb-forprint:MA13-1: PIN HEADER; OC_FARNELL: unknown; OC_NEWARK: unknown
MPU9250 = 0con-lstb:MA10-1: PIN HEADER; OC_FARNELL: unknown; OC_NEWARK: unknown
PAD2 = wirepad:SMD5: SMD PAD
Q1 Q2 = 0Murata-ceralocks-forprint:CSTLS_X: Ceramic resonator 16.00 to 70.00 MHz
Q3 = transistor-power:IRF9530: P-CHANNEL HEXFET POWER-MOS-FET Source: http://www.irf.com/product-info/datasheets/data/irf9530.pdf
RESET-MEGA1 RESET-MEGA2 RESET-XMEGA = forprint:DTS-6
RO1 RO2 SUOPPLY-SW1 = forprint:XH-3: low insertion CON
S1 = switch-dil-forprint:DIP08S: DIL/CODE SWITCH; OC_FARNELL: unknown; OC_NEWARK: unknown
SPI4-SPI7 = 0con-lstb:MA05-1: PIN HEADER; OC_FARNELL: unknown; OC_NEWARK: unknown
SPI-SW1 = switch-dil:DIP03YL: DIL/CODE SWITCH
SV3 = con-harting-ml:ML6: HARTING; OC_FARNELL: unknown; OC_NEWARK: unknown
TENKEY = 0con-lstb:MA08-1: PIN HEADER; OC_FARNELL: unknown; OC_NEWARK: unknown
U1 = atmel-xmega:ATXMEGA128A1U: 8/16-bit XMEGA A1U Microcontroller Features High-performance, low-power Atmel® AVR® XMEGA® 8/16-bit Microcontroller Nonvolatileprogram and data memories – 64K - 128KBytes of in-system self-programmable flash – 4K - 8KBytes boot section – 2KBytes EEPROM – 4K - 8KBytes internal SRAM External bus interface for up to 16Mbytes SRAM External bus interface for up to 128Mbit SDRAM Peripheral features – Four-channel DMA controller – Eight-channel event system – Eight 16-bit timer/counters Four timer/counters with 4 output compare or input capture channels Four timer/counters with 2 output compare or input capture channels High resolution extension on all timer/counters Advanced waveform extension (AWeX) on two timer/counters – One USB device interface USB 2.0 full speed (12Mbps) and low speed (1.5Mbps) device compliant 32 Endpoints with full configuration flexibility – Eight USARTs with IrDA support for one USART – Four two-wire interfaces with dual address match (I2C and SMBus compatible) – Four serial peripheral interfaces (SPIs) – AES and DES crypto engine – CRC-16 (CRC-CCITT) and CRC-32 (IEEE® 802.3) generator – 16-bit real time counter (RTC) with separate oscillator – Two sixteen channel, 12-bit, 2msps Analog to Digital Converters – Two Two-channel, 12-bit, 1msps Digital to Analog Converters – Four Analog Comparators (ACs) with window compare function, and current sources – External interrupts on all general purpose I/O pins – Programmable watchdog timer with separate on-chip ultra low power oscillator – QTouch® library support Capacitive touch buttons, sliders and wheels Special microcontroller features – Power-on reset and programmable brown-out detection – Internal and external clock options with PLL and prescaler – Programmable multilevel interrupt controller – Five sleep modes – Programming and debug interfaces JTAG (IEEE 1149.1 compliant) interface, including boundary scan PDI (Program and Debug Interface) I/O and packages – 78 Programmable I/O pins – 100 lead TQFP – 100 ball BGA – 100 ball VFBGA Operating voltage – 1.6 – 3.6V Operating frequency – 0 – 12MHz from 1.6V – 0 – 32MHz from 2.7V
VOL-LED VOLTAGE-METER = forprint:XH-2: low insertion CON
X1 = kamiki-dcjack:DCJACK: DC JACK 2.1mmφ - 5.5mmφ DCジャック、基板用。